# Altium schematic sheet arduino.SchDoc
size A4; SheetNumber: 3; SheetTotal: 3
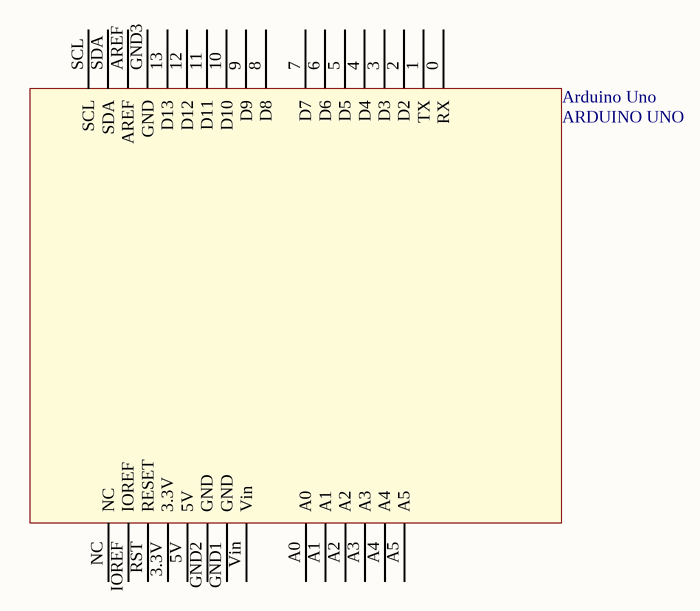
[diagram p0: arduino.SchDoc]

## Parts
Arduino_Uno  ARDUINO UNO  [ARDUINO UNO]

## Nets

Not connected (* = marked no-connect by the designer): Arduino_Uno 0(RX) 1(TX) 2(D2) 3(D3) 3.3V 4(D4) 5(D5) 5V 6(D6) 7(D7) 8(D8) 9(D9) 10(D10) 11(D11) 12(D12) 13(D13) A0 A1 A2 A3 A4 A5 AREF GND1(GND) GND2(GND) GND3(GND) IOREF NC RST(RESET) SCL SDA Vin